# Altium schematic sheet [02]Power.SchDoc
size A3
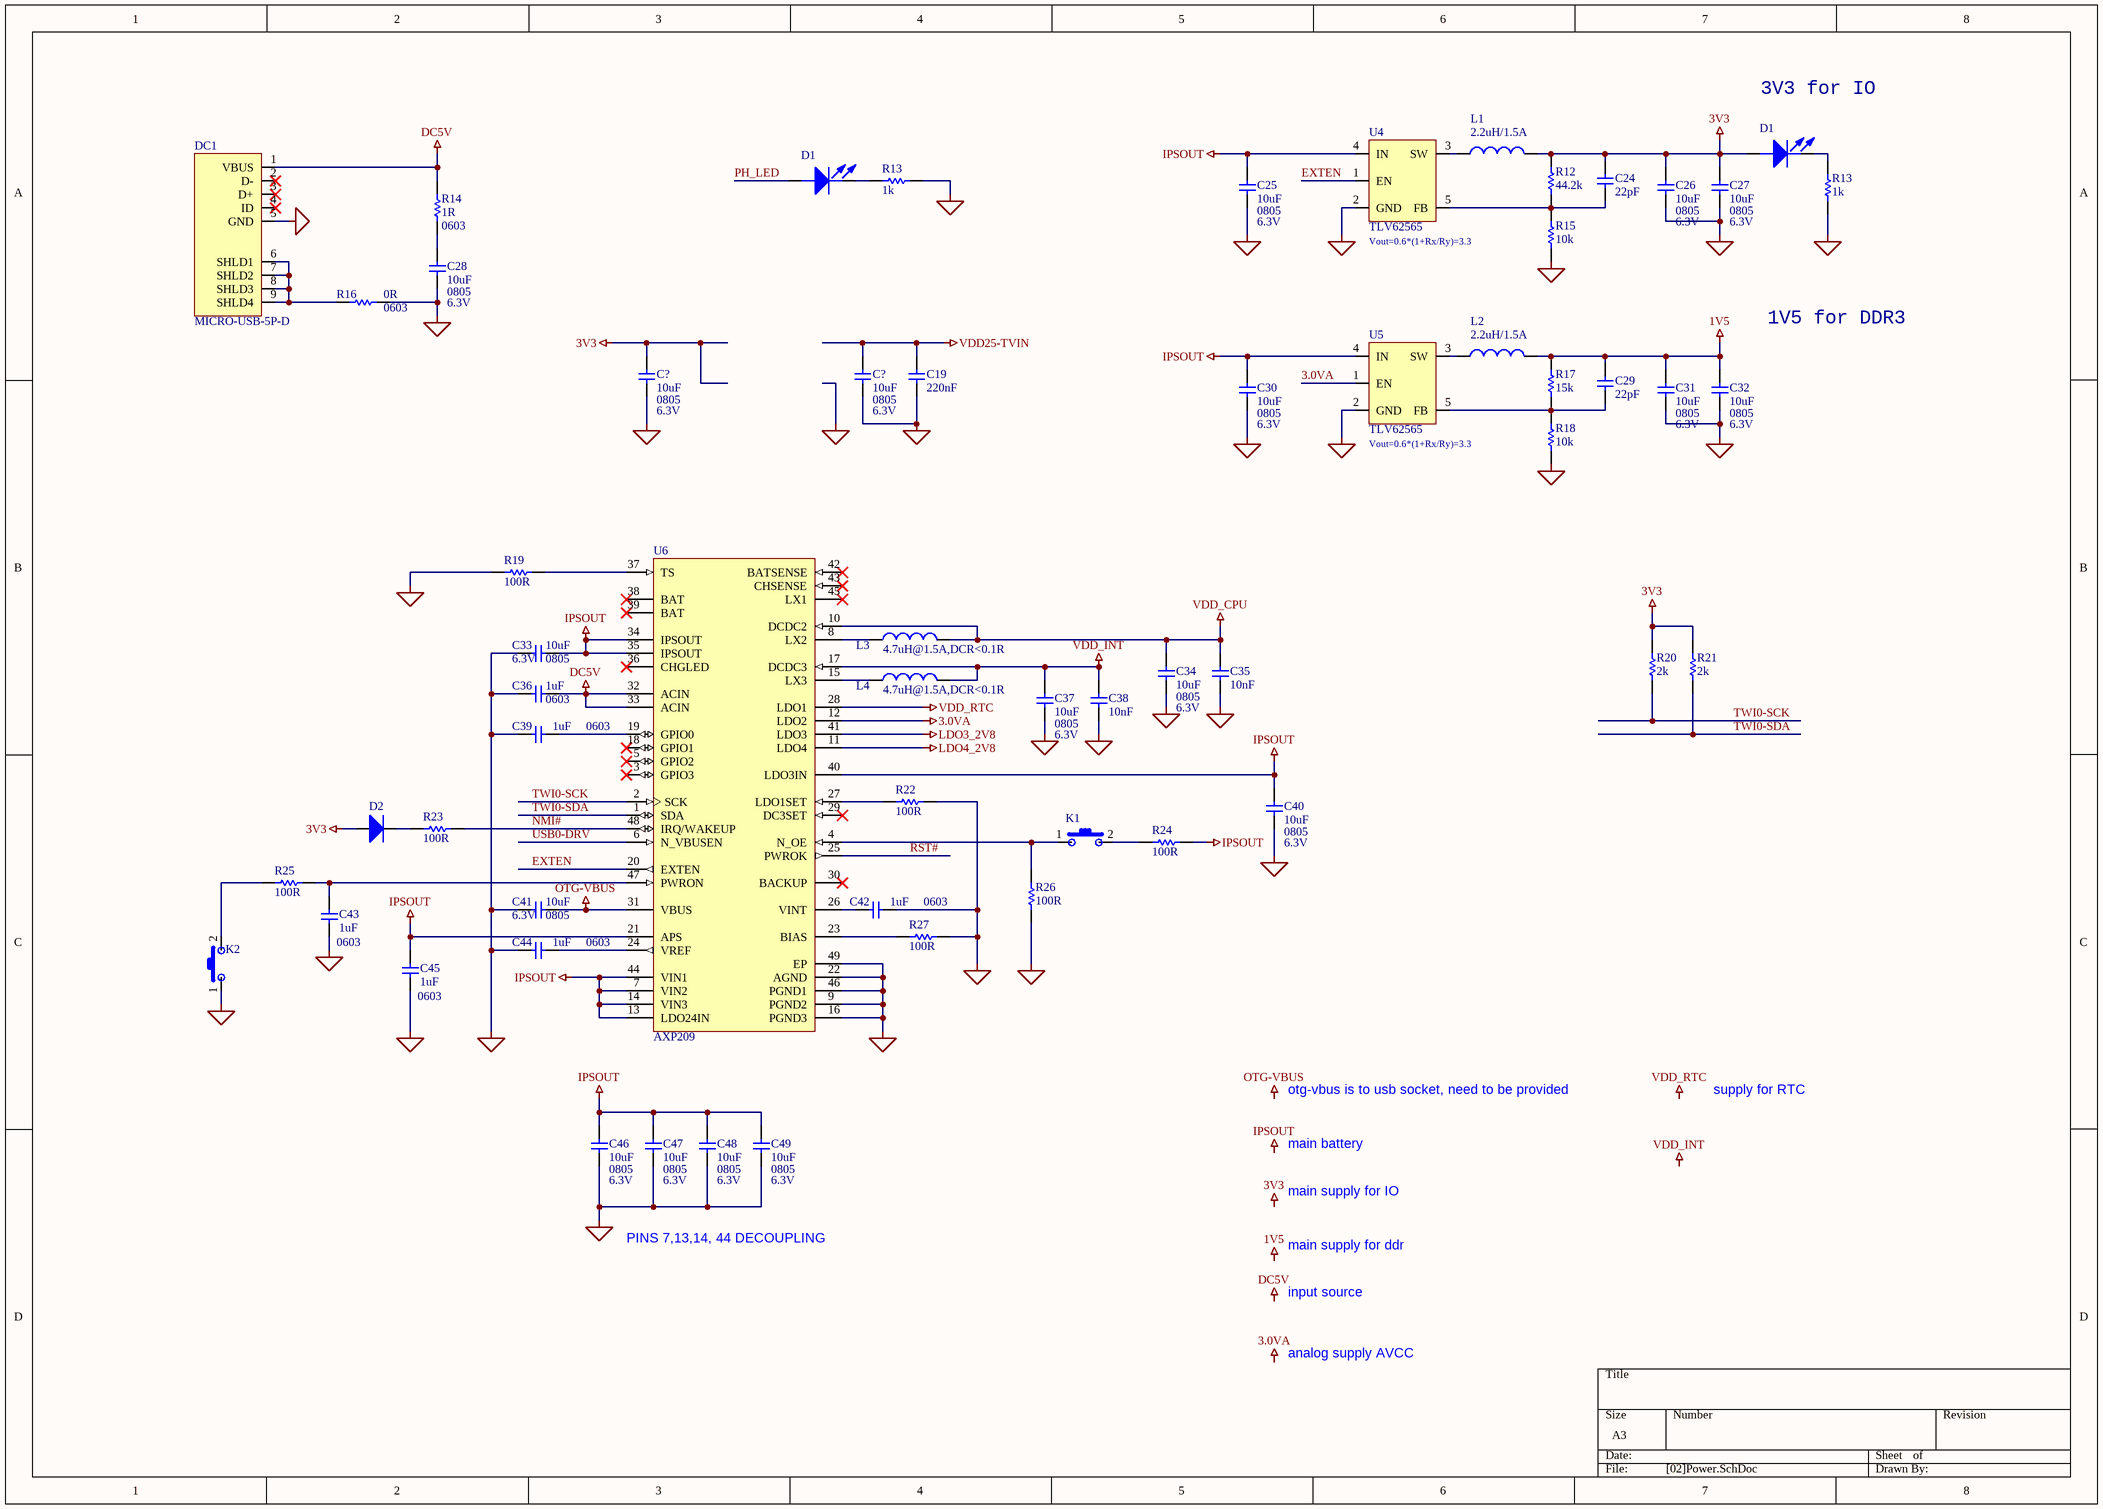
[diagram p0: [02]Power.SchDoc]

## Parts
(Parts that share a designator on the sheet are numbered #1, #2 ... from top to bottom, then left to right.)
C19  value 220nF  [C0402]  (hidden comment: SMD Capacitor Chip)
C24  value 22pF  [C0402]  (hidden comment: SMD Capacitor Chip)
C25  value 10uF  Voltage: 6.3V  Package / Case: 0805  [C0805]  (hidden comment: SMD Capacitor Chip)
C26  value 10uF  Voltage: 6.3V  Package / Case: 0805  [C0805]  (hidden comment: SMD Capacitor Chip)
C27  value 10uF  Voltage: 6.3V  Package / Case: 0805  [C0805]  (hidden comment: SMD Capacitor Chip)
C28  value 10uF  Voltage: 6.3V  Package / Case: 0805  [C0805]  (hidden comment: SMD Capacitor Chip)
C29  value 22pF  [C0402]  (hidden comment: SMD Capacitor Chip)
C30  value 10uF  Voltage: 6.3V  Package / Case: 0805  [C0805]  (hidden comment: SMD Capacitor Chip)
C31  value 10uF  Voltage: 6.3V  Package / Case: 0805  [C0805]  (hidden comment: SMD Capacitor Chip)
C32  value 10uF  Voltage: 6.3V  Package / Case: 0805  [C0805]  (hidden comment: SMD Capacitor Chip)
C33  value 10uF  Voltage: 6.3V  Package / Case: 0805  [C0805]  (hidden comment: SMD Capacitor Chip)
C34  value 10uF  Voltage: 6.3V  Package / Case: 0805  [C0805]  (hidden comment: SMD Capacitor Chip)
C35  value 10nF  [C0402]  (hidden comment: SMD Capacitor Chip)
C36  value 1uF  Package / Case: 0603  [C0603]  (hidden comment: SMD Capacitor Chip)
C37  value 10uF  Voltage: 6.3V  Package / Case: 0805  [C0805]  (hidden comment: SMD Capacitor Chip)
C38  value 10nF  [C0402]  (hidden comment: SMD Capacitor Chip)
C39  value 1uF  Package / Case: 0603  [C0603]  (hidden comment: SMD Capacitor Chip)
C40  value 10uF  Voltage: 6.3V  Package / Case: 0805  [C0805]  (hidden comment: SMD Capacitor Chip)
C41  value 10uF  Voltage: 6.3V  Package / Case: 0805  [C0805]  (hidden comment: SMD Capacitor Chip)
C42  value 1uF  Package / Case: 0603  [C0603]  (hidden comment: SMD Capacitor Chip)
C43  value 1uF  Package / Case: 0603  [C0603]  (hidden comment: SMD Capacitor Chip)
C44  value 1uF  Package / Case: 0603  [C0603]  (hidden comment: SMD Capacitor Chip)
C45  value 1uF  Package / Case: 0603  [C0603]  (hidden comment: SMD Capacitor Chip)
C46  value 10uF  Voltage: 6.3V  Package / Case: 0805  [C0805]  (hidden comment: SMD Capacitor Chip)
C47  value 10uF  Voltage: 6.3V  Package / Case: 0805  [C0805]  (hidden comment: SMD Capacitor Chip)
C48  value 10uF  Voltage: 6.3V  Package / Case: 0805  [C0805]  (hidden comment: SMD Capacitor Chip)
C49  value 10uF  Voltage: 6.3V  Package / Case: 0805  [C0805]  (hidden comment: SMD Capacitor Chip)
C?#1  value 10uF  Voltage: 6.3V  Package / Case: 0805  [C0805]  (hidden comment: SMD Capacitor Chip)
C?#2  value 10uF  Voltage: 6.3V  Package / Case: 0805  [C0805]  (hidden comment: SMD Capacitor Chip)
D1#1  SMD Led Diode  (value not drawn)
D1#2  SMD Led Diode  (value not drawn)
D2  Diode SMD Chip  (value not drawn)
DC1  MPN: MICRO-USB-5P-D  (hidden comment: SMD USB Jack)
K1  SMD Tact Switch  (value not drawn)
K2  SMD Tact Switch  (value not drawn)
L1  value 2.2uH/1.5A  (hidden comment: SMD Coil Chip)
L2  value 2.2uH/1.5A  (hidden comment: SMD Coil Chip)
L3  value 4.7uH@1.5A,DCR<0.1R  (hidden comment: SMD Coil Chip)
L4  value 4.7uH@1.5A,DCR<0.1R  (hidden comment: SMD Coil Chip)
R12  value 44.2k  (hidden comment: SMD Resistor Chip)
R13#1  value 1k  (hidden comment: SMD Resistor Chip)
R13#2  value 1k  (hidden comment: SMD Resistor Chip)
R14  value 1R  Package / Case: 0603  (hidden comment: SMD Resistor Chip)
R15  value 10k  (hidden comment: SMD Resistor Chip)
R16  value 0R  Package / Case: 0603  (hidden comment: SMD Resistor Chip)
R17  value 15k  (hidden comment: SMD Resistor Chip)
R18  value 10k  (hidden comment: SMD Resistor Chip)
R19  value 100R  (hidden comment: SMD Resistor Chip)
R20  value 2k  (hidden comment: SMD Resistor Chip)
R21  value 2k  (hidden comment: SMD Resistor Chip)
R22  value 100R  (hidden comment: SMD Resistor Chip)
R23  value 100R  (hidden comment: SMD Resistor Chip)
R24  value 100R  (hidden comment: SMD Resistor Chip)
R25  value 100R  (hidden comment: SMD Resistor Chip)
R26  value 100R  (hidden comment: SMD Resistor Chip)
R27  value 100R  (hidden comment: SMD Resistor Chip)
U4  MPN: TLV62565  (hidden comment: SMD Step-Down Converter)
U5  MPN: TLV62565  (hidden comment: SMD Step-Down Converter)
U6  AXP209  [XPWR-QFN48-4100X4100TP_N]

## Nets
1V5: C29.1 C31.1 C32.1 L2.2 R17.2
3.0VA: U5.1(EN) U6.12(LDO2)
3V3: C24.1 C26.1 C27.1 C?#1.1 D1#1.1 D2.1(A) L1.2 R12.2 R20.2 R21.2
DC5V: C36.1 DC1.1(VBUS) R14.2 U6.32(ACIN) U6.33(ACIN)
IPSOUT: C25.1 C30.1 C33.1 C40.1 C45.2 C46.1 C47.1 C48.1 C49.1 R24.1 U4.4(IN) U5.4(IN) U6.7(VIN2) U6.13(LDO24IN) U6.14(VIN3) U6.21(APS) U6.34(IPSOUT) U6.35(IPSOUT) U6.40(LDO3IN) U6.44(VIN1)
LDO3_2V8: U6.41(LDO3)
LDO4_2V8: U6.11(LDO4)
OTG-VBUS: C41.1 U6.31(VBUS)
SGND: C19.1 C25.2 C26.2 C27.2 C28.2 C30.2 C31.2 C32.2 C33.2 C34.2 C35.1 C36.2 C37.2 C38.1 C39.2 C40.2 C41.2 C42.1 C43.1 C44.2 C45.1 C46.2 C47.2 C48.2 C49.2 C?#1.2 C?#2.2 DC1.5(GND) K2.1 R13#1.1 R13#2.1 R15.1 R16.1 R18.1 R19.1 R22.1 R26.1 R27.2 U4.2(GND) U5.2(GND) U6.9(PGND2) U6.16(PGND3) U6.22(AGND) U6.46(PGND1) U6.49(EP)
VDD25-TVIN: C19.2 C?#2.1
VDD_CPU: C34.1 C35.2 L3.2 U6.10(DCDC2)
VDD_INT: C37.1 C38.2 L4.2 U6.17(DCDC3)
VDD_RTC: U6.28(LDO1)
EXTEN: U4.1(EN) U6.20(EXTEN)
NMI#: R23.2 U6.48(IRQ/WAKEUP)
PH_LED: D1#2.1
RST#: U6.25(PWROK)
TWI0-SCK: R20.1 U6.2(SCK)
TWI0-SDA: R21.1 U6.1(SDA)
USB0-DRV: U6.6(N_VBUSEN)
NetC24_2: C24.2 R12.1 R15.2 U4.5(FB)
NetC28_1: C28.1 R14.1
NetC29_2: C29.2 R17.1 R18.2 U5.5(FB)
NetC39_1: C39.1 U6.19(GPIO0)
NetC42_2: C42.2 U6.26(VINT)
NetC43_2: C43.2 R25.2 U6.47(PWRON)
NetC44_1: C44.1 U6.24(VREF)
NetD1#1_2: D1#1.2 R13#2.2
NetD1#2_2: D1#2.2 R13#1.2
NetD2_2: D2.2(K) R23.1
NetDC1_6: DC1.6(SHLD1) DC1.7(SHLD2) DC1.8(SHLD3) DC1.9(SHLD4) R16.2
NetK1_1: K1.1 R26.2 U6.4(N_OE)
NetK1_2: K1.2 R24.2
NetK2_2: K2.2 R25.1
NetL1_1: L1.1 U4.3(SW)
NetL2_1: L2.1 U5.3(SW)
NetL3_1: L3.1 U6.8(LX2)
NetL4_1: L4.1 U6.15(LX3)
NetR19_2: R19.2 U6.37(TS)
NetR22_2: R22.2 U6.27(LDO1SET)
NetR27_1: R27.1 U6.23(BIAS)

Not connected (* = marked no-connect by the designer): DC1 2(D-)* 3(D+)* 4(ID)*; U6 3(GPIO3)* 5(GPIO2)* 18(GPIO1)* 29(DC3SET)* 30(BACKUP)* 36(CHGLED)* 38(BAT)* 39(BAT)* 42(BATSENSE)* 43(CHSENSE)* 45(LX1)*

## Notes on the sheet
- 3V3 for IO
- (near U4) Vout=0.6*(1+Rx/Ry)=3.3
- 1V5 for DDR3
- (near U5) Vout=0.6*(1+Rx/Ry)=3.3
- otg-vbus is to usb socket, need to be provided
- supply for RTC
- main battery
- PINS 7,13,14, 44 DECOUPLING
- main supply for IO
- main supply for ddr
- input source
- analog supply AVCC
- Labels drawn without touching a wire or pin: 1V5, 3.0VA, 3V3, DC5V, IPSOUT, OTG-VBUS, VDD_INT, VDD_RTC

## Library data of the parts
C19 C24 C29 C35 C38 = CAP: SMD Capacitor; Tolerance: 20%; Voltage: 50V; MPN: ?; Package / Case: 0402
C25-C28 C30-C34 C37 C40 C41 C46-C49 C?#1 C?#2 = CAP: SMD Capacitor; Tolerance: 20%; MPN: ?
C36 C39 C42-C45 = CAP: SMD Capacitor; Tolerance: 20%; Voltage: 16V; MPN: ?
D1#1 D1#2 = LED: SMD Led Diode Chip; MPN: ?; Package / Case: LED0805; Manufacturer: ?
D2 = DIODE: SMD Diode; MPN: ?; Value: ?; Voltage: ?
DC1 = USB-JACK: SMD USB DC Jack
K1 K2 = BUTTON: MPN: ?
L1-L4 = COIL: SMD Coil; Current Rating: 1A; Inductance: 4.7uH; MPN: ?; Series Resistance: ?
R12 R13#1 R13#2 R14-R27 = RES: SMD Resistor; Tolerance: 1%; MPN: ?
  R12 R13#1 R13#2 R15 R17 R18: Package / Case: 0603
  R19-R27: Package / Case: 0402
U4 U5 = TLV6256x: TLV6256x 1.5-A High Efficiency Step-Down Converters in SOT-23 5-Pin Package; Manufacturer: Texas Instruments
U6 = CMP-0571-00001-2: Enhanced Single Cell Li-Battery and Power System Management IC, 2 Channel Buck DC-DC Converter, 5 Channel LDO, 12-Bit ADC, 4 Channel GPIO, -40 to 130 degC, 48-Pin QFN; Manufacturer: X-Powers; Iout: 2500 mA; ACIN Under Voltage Locout: 3.8 V; Oscillator Frequency: 1.5 MHz; Charge Current: 1200 mA; ACIN Input Voltage: 3.8 to 6.3 V; ComponentLink2URL: http://www.x-powers.com/download/AXP209%20Datasheet%20v1.0_cn.pdf; ComponentLink1URL: http://www.x-powers.com/; PackageDescription: 48-Pin Quad Flat No-Lead Package, Body 6 x 6 mm, Pitch 0.4 mm; Operating Temperature Range: -40 to 130 degC; PackageReference: QFN-48; ComponentLink1Description: Manufacturer URL; PartNumber: AXP209; DatasheetVersion: V1.0; Mounting Technology: Surface Mount; ComponentLink2Description: Datasheet